# EAGLE design Capacitive Moisture Sensor REV 02 (EAGLE 9.6.2)
Schematic of a soil moisture sensor inspired by the Grove Capacitor Soil Moisture Sensor
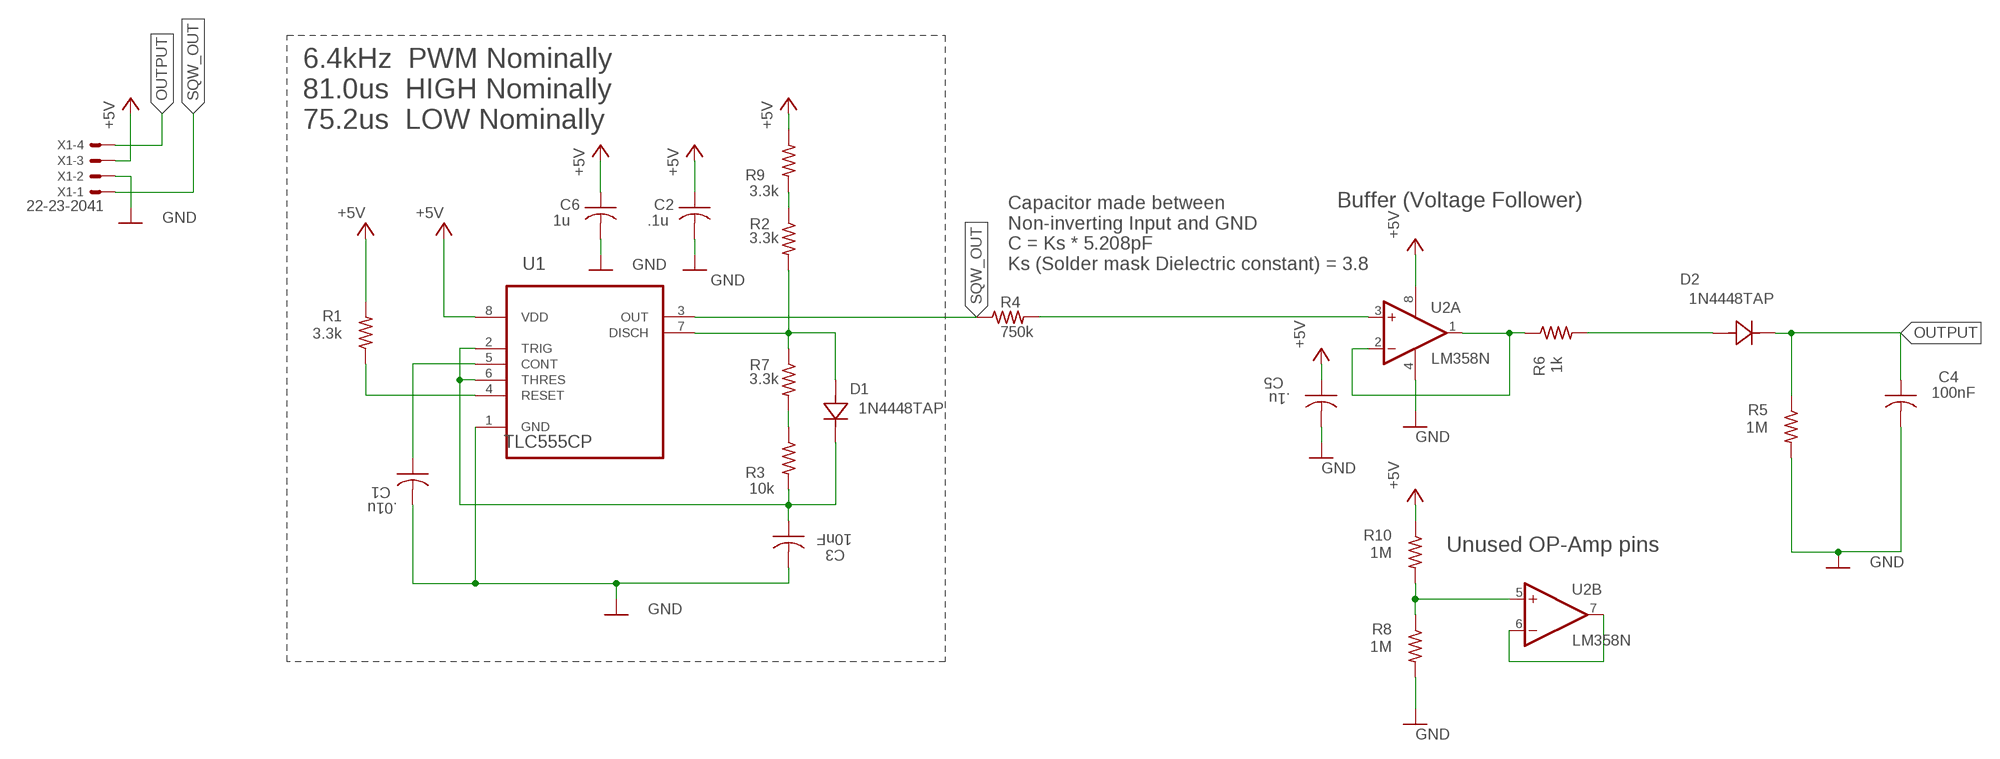
[diagram p0: schematic, sheet 1]

## Parts
C1  .01u  C-USC1206  [C1206]
C2  .1u  C-USC1206  [C1206]
C3  10nF  C-USC1206  [C1206]
C4  100nF  C-USC1206  [C1206]
C5  .1u  C-USC1206  [C1206]
C6  1u  C-USC1206  [C1206]
D1  1N4448TAP  [DO-35]
D2  1N4448TAP  [DO-35]
R1  3.3k  R-US_R1206  [R1206]
R2  3.3k  R-US_R1206  [R1206]
R3  10k  R-US_R1206  [R1206]
R4  750k  R-US_R1206  [R1206]
R5  1M  R-US_R1206  [R1206]
R6  1k  R-US_R1206  [R1206]
R7  3.3k  R-US_R1206  [R1206]
R8  1M  R-US_R1206  [R1206]
R9  3.3k  R-US_R1206  [R1206]
R10  1M  R-US_R1206  [R1206]
U1  TLC555CP  [DIP254P762X508-8]
U2  LM358N  [DIL08]
X1  22-23-2041  [22-23-2041]

## Nets
+5V: C2.1 C5.1 C6.1 R1.2 R9.1 R10.1 U1.8(VDD) U2.8(P:V+) X1.3
GND: C1.2 C2.2 C3.2 C4.2 C5.2 C6.2 R5.2 R8.2 U1.1(GND) U2.4(P:V-) X1.2
N$1: U2.6(B:-IN) U2.7(B:OUT)
N$2: C3.1 D1.1 R3.2 U1.2(TRIG) U1.6(THRES)
N$3: R1.1 U1.4(RESET)
N$4: C1.1 U1.5(CONT)
N$5: D2.2 R6.2
N$6: R3.1 R7.2
N$7: R4.2 U2.3(A:+IN)
N$8: R2.1 R9.2
N$9: R6.1 U2.1(A:OUT) U2.2(A:-IN)
N$10: D1.2 R2.2 R7.1 U1.7(DISCH)
N$11: R8.1 R10.2 U2.5(B:+IN)
OUTPUT: C4.1 D2.1 R5.1 X1.4
SQW_OUT: R4.1 U1.3(OUT) X1.1

## Notes on the sheet
- 6.4kHz  PWM Nominally
  81.0us  HIGH Nominally 
  75.2us  LOW Nominally
- Buffer (Voltage Follower)
- Capacitor made between 
  Non-inverting Input and GND
  C = Ks * 5.208pF
  Ks (Solder mask Dielectric constant) = 3.8
- Unused OP-Amp pins

## Library data of the parts
C1-C6 = rcl:C-US: CAPACITOR, American symbol; SPICEPREFIX: C
D1 D2 = 1N4448TAP:1N4448TAP; BUILT_BY: EMA_UL_Team; MANUFACTURER_PART_NUMBER: 1N4448TAP; VENDOR: Vishay
R1-R10 = rcl:R-US_: RESISTOR, American symbol; SPICEPREFIX: R
U1 = TLC555CP:TLC555CP: LinCMOSE TIMERS; AVAILABILITY: Unavailable; DESCRIPTION: 555 Type, Timer/Oscillator _Single_ IC 2.1MHz 8-PDIP; MF: Texas Instruments; MP: TLC555CP; PACKAGE: PDIP-8 STMicroelectronics; PRICE: None
U2 = linear:LM358: OP AMP also LM158; LM258; LM2904 Source: http://cache.national.com/ds/LM/LM158.pdf
X1 = con-molex:22-23-2041: .100" (2.54mm) Center Header - 4 Pin; MF: MOLEX; MPN: 22-23-2041; OC_FARNELL: 1462920; OC_NEWARK: 38C0355

## Net classes
0 default: clearance 0.205 mm

## Board
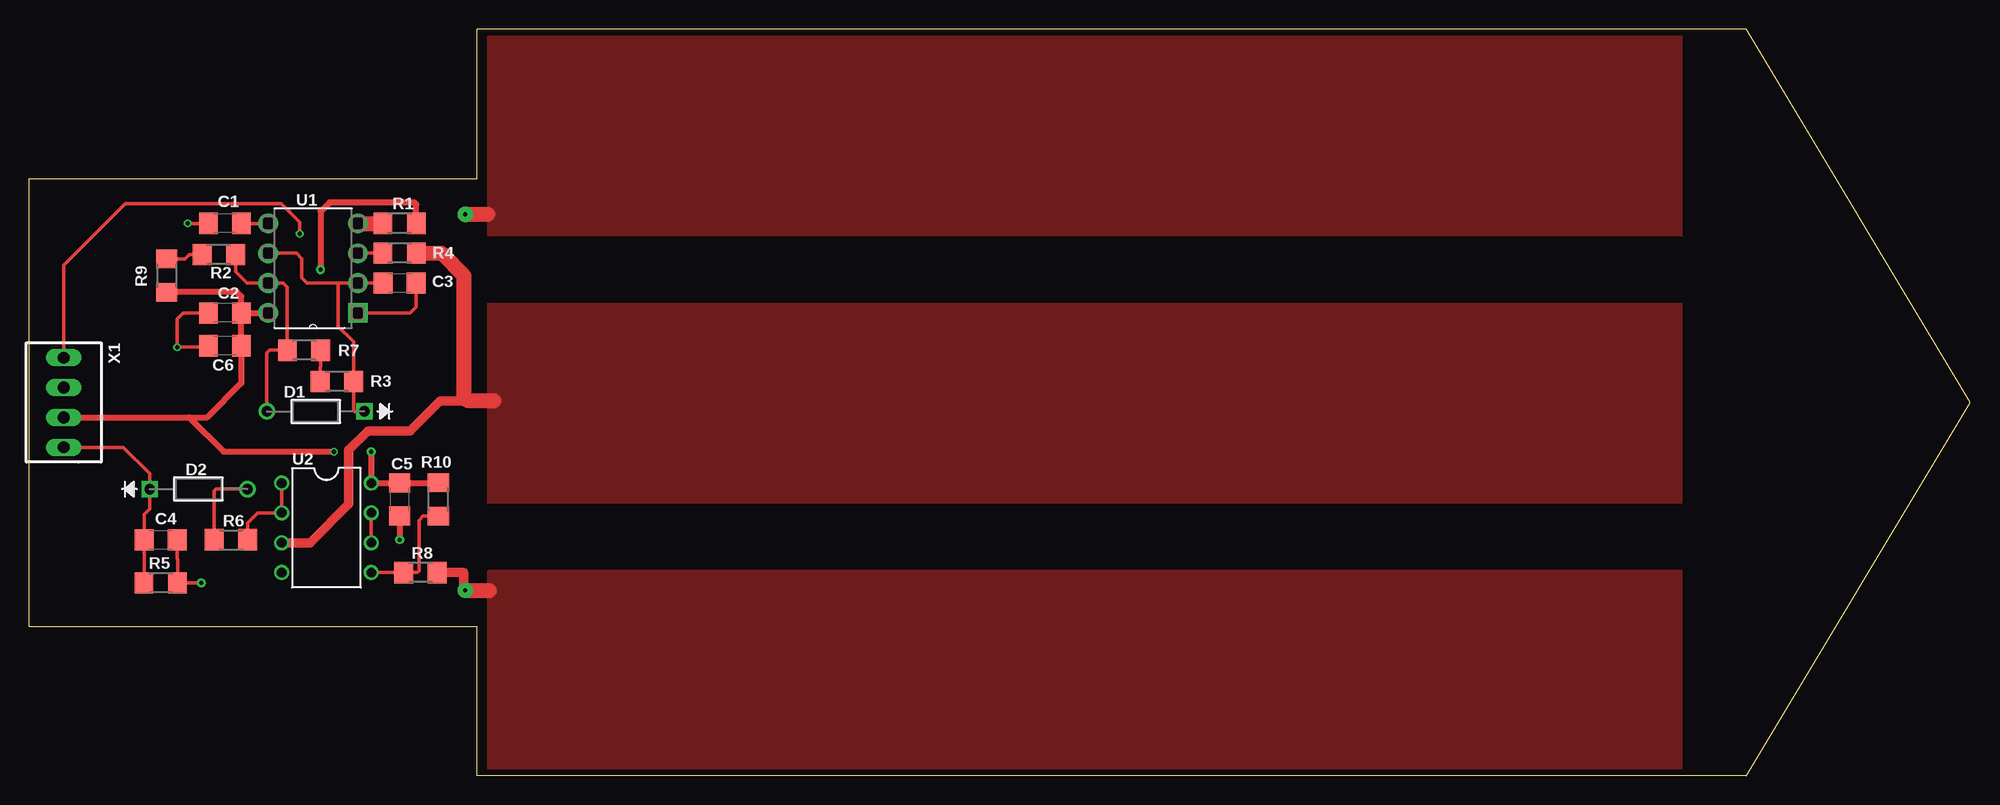
[diagram p1: board, top side]
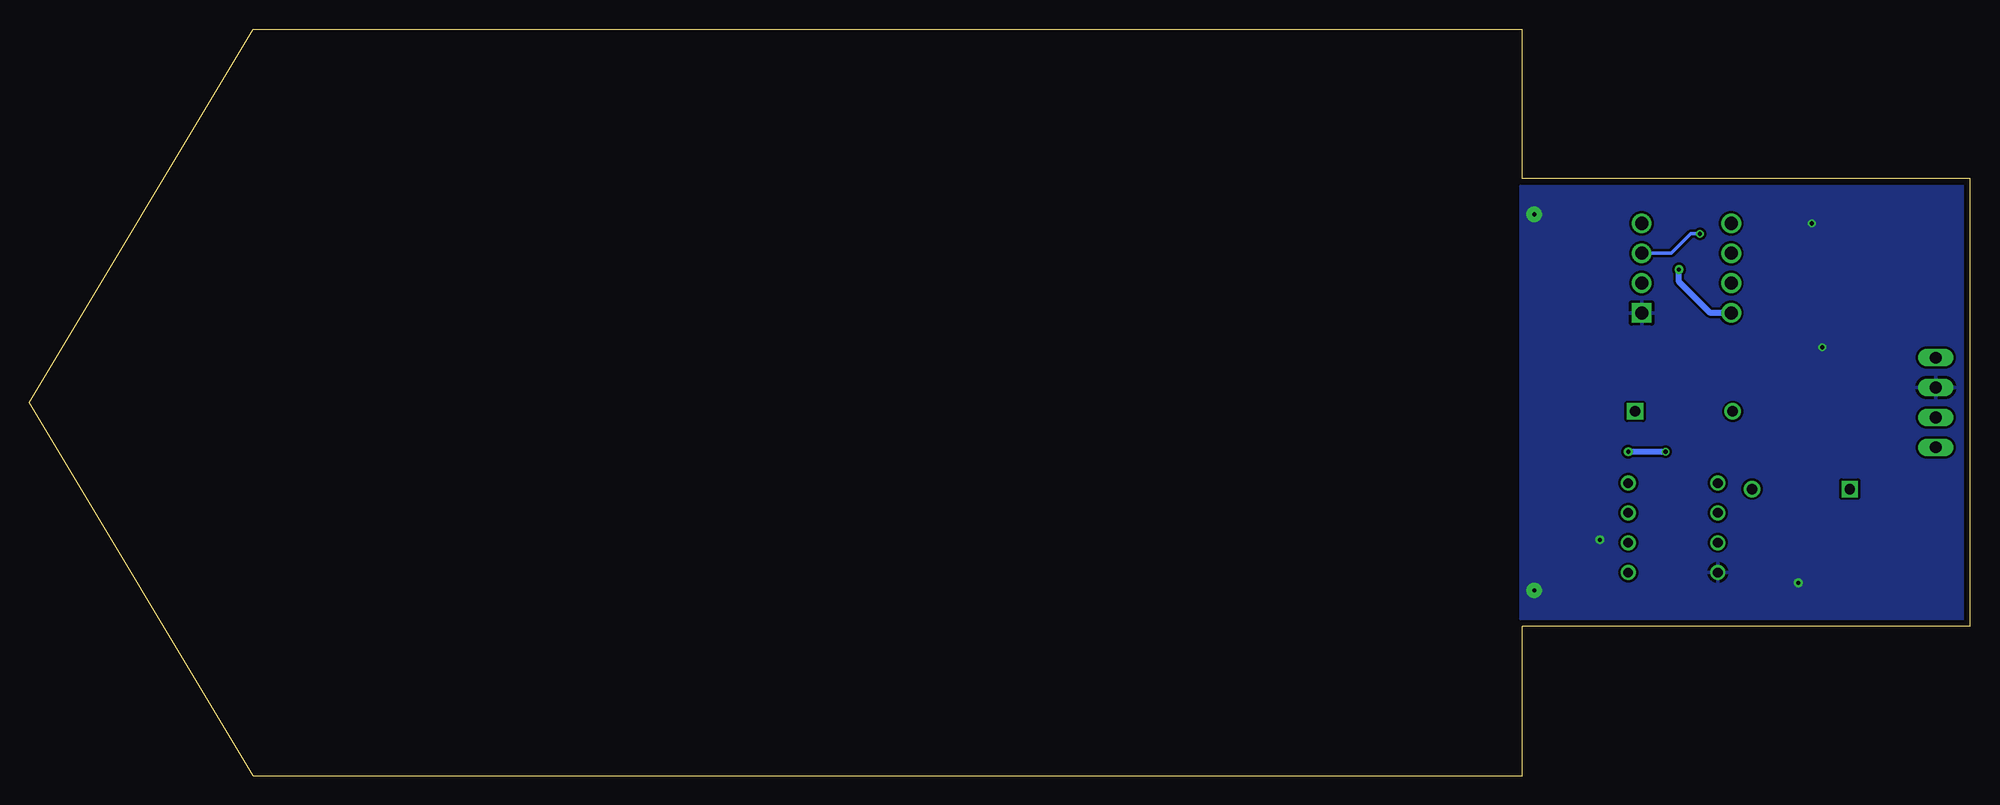
[diagram p2: board, bottom side, seen from below]

Size 165.1 x 63.5 mm. Coordinates in mm from the lower left corner, seen from the top.
Outline: 0,12.7 0,50.8 38.1,50.8 38.1,63.5 146.05,63.5 165.1,31.75 146.05,0 38.1,0 38.1,12.7 0,12.7
Copper layers (1*16): Top 0.035mm / dielectric 1.5mm / Bottom 0.035mm
Design rules "default *": minimum track width 5mil, minimum drill 12mil, track to track 5mil, track to pad 22mil, pad to pad 6mil, via to via 8mil, smd to smd 6mil, copper to edge 20mil, drill to drill 20mil, minimum pad ring 8mil, minimum via ring 6mil, stop-mask expansion 4mil, vias tented up to drill 0mil, thermal gap 10mil

### Footprints (pad centres in the part's own frame; a part is rotated, then mirrored left to right if it is on the bottom)
C1206 = smd 1.6 x 1.8: 1 -1.4,0; 2 1.4,0
DO-35 = drill 0.889 pad 1.397 square: 1 -8.306,0 | drill 0.889 pad 1.397: 2 0,0
R1206 = smd 1.6 x 1.803: 1 -1.422,0; 2 1.422,0
DIP254P762X508-8 = drill 1.118 square: 1 -7.62,7.62 | drill 1.118: 2 -7.62,5.08; 3 -7.62,2.54; 4 -7.62,0; 5 0,0; 6 0,2.54; 7 0,5.08; 8 0,7.62
DIL08 = drill 0.813 pad 1.27: 1 -3.81,-3.81; 2 -1.27,-3.81; 3 1.27,-3.81; 4 3.81,-3.81; 5 3.81,3.81; 6 1.27,3.81; 7 -1.27,3.81; 8 -3.81,3.81
22-23-2041 = drill 1 long: 1 -3.81,0; 2 -1.27,0; 3 1.27,0; 4 3.81,0

### Placement (x,y rotation side)
C1  16.64,46.99 180 top
C2  16.64,39.37 180 top
C3  31.5,41.91 0 top
C4  11.18,20.07 0 top
C5  31.5,23.49 270 top
C6  16.64,36.58 180 top
D1  20.19,30.99 180 top
D2  18.54,24.38 0 top
DRILEGEND  [DRILEGEND]  64.43,-13.59 0 top  (outside the outline)
R1  31.5,46.99 0 top
R2  16.13,44.32 0 top
R3  26.16,33.53 0 top
R4  31.5,44.45 0 top
R5  11.18,16.38 0 top
R6  17.14,20.07 180 top
R7  23.37,36.2 0 top
R8  33.27,17.27 0 top
R9  11.68,42.55 90 top
R10  34.8,23.49 270 top
U1  20.32,46.99 180 top
U2  25.27,21.08 270 top
X1  2.92,31.75 270 top

### Tracks (layer width: path | path; a pad name or v marks a point on that pad's centre or on a via)
+5V  (via drill 0.35, 0.35 pad 0.75)
  Top 0.508: C2.1 U1.8 | v24.77,43.05 24.77,48.01 25.53,48.77 32.77,48.77 32.92,48.62 R1.2 | C2.1 C6.1 18.04,33.4 15.11,30.48 13.59,30.48 | C2.1 18.04,40.76 17.65,41.15 11.71,41.15 R9.1 | U2.8 C5.1 34.78,24.89 R10.1 | X1.3 13.59,30.48 | v25.91,27.56 16.51,27.56 13.59,30.48 | v29.08,27.56 U2.8
  Top 1.27: U2.8
  Bottom 0.508: U1.8 22.1,39.37 24.77,42.04 v24.77,43.05 | v29.08,27.56 v25.91,27.56
GND  (via drill 0.35, 0.35 pad 0.75, 0.35 pad 1.3)
  Top 0.305: C1.2 v13.46,46.99 | v14.61,16.38 R5.2 12.6,18.39 12.57,18.41 C4.2 | C2.2 13.08,39.37 12.57,38.86 v12.57,36.45 15.11,36.45 C6.2 | C3.2 32.9,39.88 32.38,39.37 U1.1
  Top 0.508: C5.2 v31.5,20.07
  Top 0.813: v37.08,15.75 36.96,15.88 36.96,17.27 R8.2
  Top 1.27: 38.99,47.75 v37.08,47.75 | v37.08,15.75 39.12,15.75
  pour Bottom: 0.64,50.17 0.64,13.33 38.23,13.33 38.23,50.17
  pour Top: 38.99,0.51 140.59,0.51 140.59,17.4 38.99,17.4
  pour Top: 140.59,45.97 140.59,62.86 38.99,62.86 38.99,45.97
N$1
  Top 0.305: U2.7 U2.6
N$2
  Top 0.305: U1.6 22.73,44.45 23.17,44.01 23.17,42.36 23.62,41.91 26.29,41.91 | C3.1 U1.2 26.29,41.91 | 26.29,41.91 26.29,38.23 27.58,36.93 R3.2 27.58,31.09 27.69,30.99 D1.1
N$3
  Top 1.27: U1.4 R1.1
N$4
  Top 0.305: U1.5 C1.1
N$5
  Top 0.305: R6.2 15.72,24.23 15.88,24.38 D2.2
N$6
  Top 0.305: R3.1 24.74,34.77 24.79,34.82 R7.2
N$7
  Top 0.813: 37.34,31.88 34.92,31.88 32.37,29.32 28.82,29.32 27.18,27.69 27.18,23.11 23.88,19.81 U2.3
  Top 1.27: R4.2 35.05,44.45 36.96,42.55 36.96,32.26 37.34,31.88 39.5,31.88
  pour Top: 38.99,23.24 140.59,23.24 140.59,40.13 38.99,40.13
N$8
  Top 0.305: R2.1 13.59,44.32 13.21,43.94 11.71,43.94 R9.2
N$9
  Top 0.305: U2.1 U2.2 19.43,22.35 18.57,21.49 R6.1
N$10
  Top 0.305: D1.2 20.19,32.64 20.19,35.97 20.42,36.2 R7.1 21.95,41.55 21.59,41.91 U1.7 18.54,41.91 17.55,42.9 R2.2
N$11
  Top 0.305: U2.5 R8.1 32.99,17.27 33.15,17.42 33.15,21.72 33.5,22.07 R10.2
OUTPUT
  Top 0.305: X1.4 8,27.94 10.24,25.7 D2.1 10.24,22.68 9.78,22.22 C4.1 9.78,16.41 R5.1
SQW_OUT  (via drill 0.35)
  Top 0.305: U1.3 R4.1 | v22.99,46.1 22.99,47.12 21.44,48.67 8.15,48.67 2.92,43.43 X1.1
  Bottom 0.305: U1.3 25.4,44.45 23.75,46.1 v22.99,46.1

### Text on the board
DrillLegend: LAYER-STACK
DrillLegend_01-16: 01-16